# Altium schematic sheet 26_按键接口.schdoc.schdoc
size A; Symbol: Sheet-Symbol_A4; Device: Sheet-Symbol_A4; Company: 嘉立创EDA; Version: V1.0; Page Size: A4; @Project Name: RK3568底板_V1.2; @Page Count: 6; @Update Date: 2024-04-19; @Create Date: 2024-04-18; @Schematic Name: 原理图; @Page No: 3; @Page Name: 外设接口
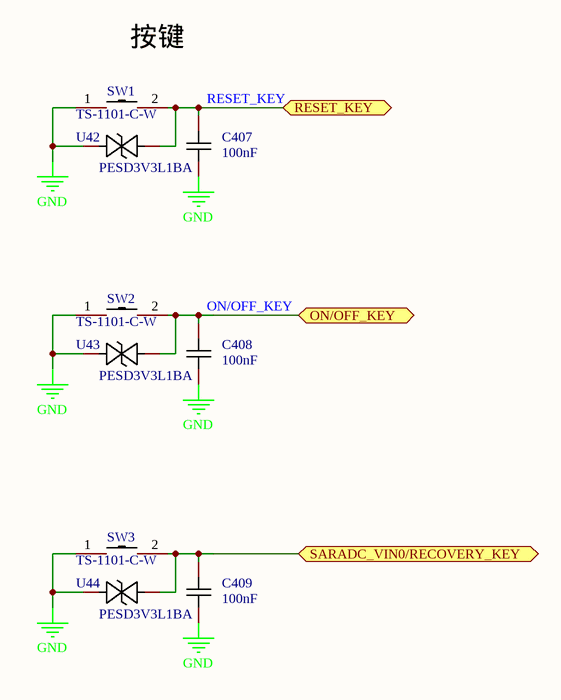
[diagram p0: 26_按键接口.schdoc.schdoc]

## Parts
C407  100nF  [C0603]
C408  100nF  [C0603]
C409  100nF  [C0603]
SW1  TS-1101-C-W  [SW-SMD_L6.0-W3.3-LS8.0]
SW2  TS-1101-C-W  [SW-SMD_L6.0-W3.3-LS8.0]
SW3  TS-1101-C-W  [SW-SMD_L6.0-W3.3-LS8.0]
U42  PESD3V3L1BA  [SOD-323_L1.7-W1.3-LS2.6-BI]
U43  PESD3V3L1BA  [SOD-323_L1.7-W1.3-LS2.6-BI]
U44  PESD3V3L1BA  [SOD-323_L1.7-W1.3-LS2.6-BI]

## Ports
ON/OFF_KEY (bidir), RESET_KEY (bidir), SARADC_VIN0/RECOVERY_KEY (bidir)

## Nets
GND: C407.1 C408.1 C409.1 SW1.1 SW2.1 SW3.1 U42.1 U43.1 U44.1
ON/OFF_KEY: C408.2 SW2.2 U43.2 ; port ON/OFF_KEY
RESET_KEY: C407.2 SW1.2 U42.2 ; port RESET_KEY
SARADC_VIN0/RECOVERY_KEY: C409.2 SW3.2 U44.2 ; port SARADC_VIN0/RECOVERY_KEY

## Notes on the sheet
- (near SW1) 按键
- 1
- 2
- 3
- 4
- 5
- 6
- A
- B
- C
- 原理图
- 创建日期
- 更新日期
- 2024-04-19
- 2024-04-18
- 审阅
- 绘制
- 图页
- 外设接口
- 物料编码
- RK3568底板_V1.2
- D
- 版本
- 尺寸
- 页
- 共
- V1.0
- A4
- 嘉立创EDA

## Library data of the parts
C407-C409 = CC0603KRX7R9BB104: Manufacturer: YAGEO(国巨); Add into BOM: yes; Tolerance: ±10%; Voltage Rated: 50V; Temperature Coefficient: X7R; Name: 100nF; Symbol: CC0603KRX7R9BB104; Device: CC0603KRX7R9BB104; Supplier: LCSC; Manufacturer Part: CC0603KRX7R9BB104; Value: 100nF; Supplier Part: C14663; JLCPCB Part Class: 基础库; LCSC Part Name: 100nF ±10% 50V; Supplier Footprint: 0603; Datasheet: https://atta.szlcsc.com/upload/public/pdf/source/20180910/C282072_33301C7F631E79921B82A8DAC6BCC5B3.pdf; Convert to PCB: yes
SW1-SW3 = TS-1101-C-W: Manufacturer: XKB Connectivity(中国星坤); Add into BOM: yes; Circuit: 单刀单掷; Actuator Style: 矩形按钮; Operating Force: 260gf; Switch Length: 6mm; Switch Width: 3.6mm; Switch Height: 2.5mm; Strike Gundam: 不带; Contact Current: 50mA; Voltage Rating (DC): 12V; Actuator/Cap Color: 白色带淡绿; With Lamp: 无; Mechanical Life: 5万次; Name: TS-1101-C-W; Symbol: TS-1101-C-W; Device: TS-1101-C-W; Supplier: LCSC; Supplier Part: C318938; Manufacturer Part: TS-1101-C-W; JLCPCB Part Class: 扩展库; LCSC Part Name: 6*3.6*2.5mm 立贴 轻触开关; Supplier Footprint: SMD; Datasheet: https://atta.szlcsc.com/upload/public/pdf/source/20200227/C318938_C2E53B1EEDE37D980A33616AC086DE53.pdf; Convert to PCB: yes; Mounting Style: 立贴; Voltage Rating (AC): -; Power Rating: -; Insulation Resistance: -; IP Rating: -; Pin Style: -; Operating Temperature: -30℃~+85℃
U42-U44 = PESD3V3L1BA_C2687129: Manufacturer: UMW(友台半导体); Add into BOM: yes; Name: PESD3V3L1BA; Symbol: PESD3V3L1BA_C2687129; Device: PESD3V3L1BA_C2687129; LCSC Part Name: PESD3V3L1BA; Supplier Part: C2687129; Manufacturer Part: PESD3V3L1BA; Supplier Footprint: SOD-323; JLCPCB Part Class: 扩展库; Datasheet: https://atta.szlcsc.com/upload/public/pdf/source/20231109/93EB786E66E91E2C792027BF9B7AC5FE.pdf; Supplier: LCSC; Convert to PCB: yes; Type: ESD